# Altium schematic sheet DDR3.SchDoc
size A3; SheetNumber: 3; SheetTotal: 13; SPICEModelCacheAHASEUHE: <root> / <DocumentId>AHASEUHE</DocumentId> / </root>
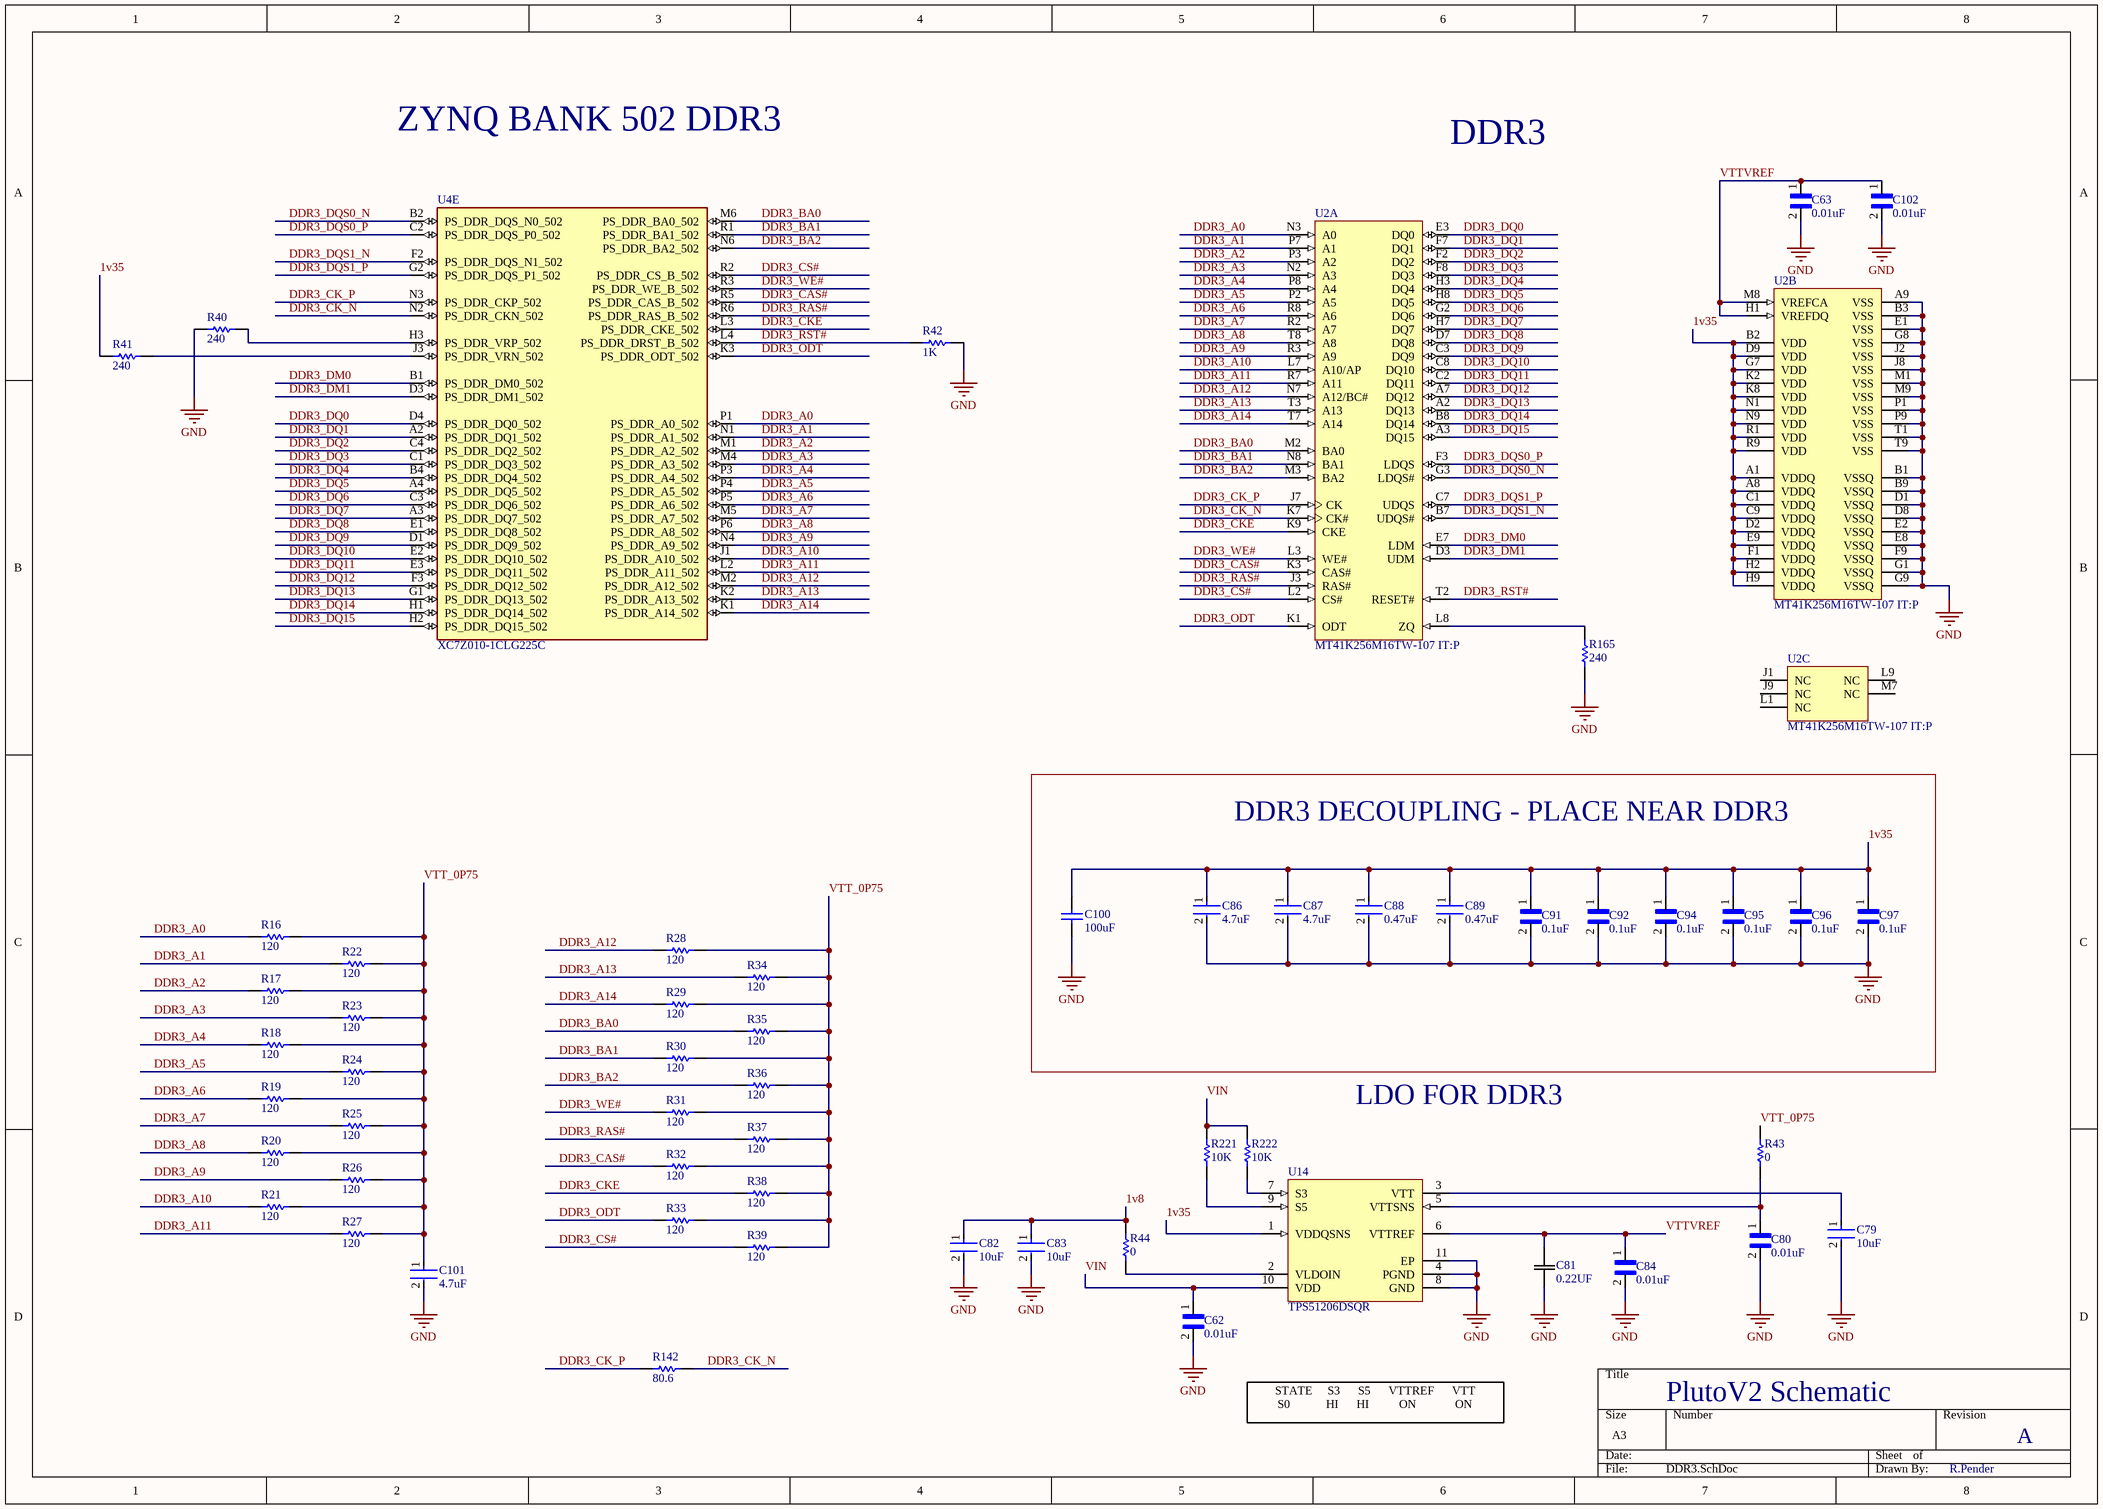
[diagram p0: DDR3.SchDoc]

## Parts
C62  0.01uF  [CAPC0603X33N]
C63  0.01uF  [CAPC0603X33N]
C79  10uF  [FP-GRM188-0_1-e0_2_0_55-IPC_A]
C80  0.01uF  [CAPC0603X33N]
C81  0.22UF  [CAP_U_0805_KNO]
C82  10uF  [FP-GRM188-0_1-e0_2_0_55-IPC_A]
C83  10uF  [FP-GRM188-0_1-e0_2_0_55-IPC_A]
C84  0.01uF  [CAPC0603X33N]
C86  4.7uF  [FP-C1005-050-0_15-MFG]
C87  4.7uF  [FP-C1005-050-0_15-MFG]
C88  0.47uF  [FP-C1005-050-0_15-MFG]
C89  0.47uF  [FP-C1005-050-0_15-MFG]
C91  0.1uF  [CAPC0603X33N]
C92  0.1uF  [CAPC0603X33N]
C94  0.1uF  [CAPC0603X33N]
C95  0.1uF  [CAPC0603X33N]
C96  0.1uF  [CAPC0603X33N]
C97  0.1uF  [CAPC0603X33N]
C100  100uF  [CAPC3216X190X55ML30T25]
C101  4.7uF  [FP-C1005-050-0_15-MFG]
C102  0.01uF  [CAPC0603X33N]
R16  120  [1-0201]
R17  120  [1-0201]
R18  120  [1-0201]
R19  120  [1-0201]
R20  120  [1-0201]
R21  120  [1-0201]
R22  120  [1-0201]
R23  120  [1-0201]
R24  120  [1-0201]
R25  120  [1-0201]
R26  120  [1-0201]
R27  120  [1-0201]
R28  120  [1-0201]
R29  120  [1-0201]
R30  120  [1-0201]
R31  120  [1-0201]
R32  120  [1-0201]
R33  120  [1-0201]
R34  120  [1-0201]
R35  120  [1-0201]
R36  120  [1-0201]
R37  120  [1-0201]
R38  120  [1-0201]
R39  120  [1-0201]
R40  240  [2-0402]
R41  240  [2-0402]
R42  1K  [2-0402]
R43  0  [RESC1005X40X25NL10T10]
R44  0  [RESC1005X40X25NL10T10]
R142  80.6  [2-0402]
R165  240  [2-0402]
R221  10K  [2-0402]
R222  10K  [2-0402]
U2  MT41K256M16TW-107 IT:P  [MICT-TW-96]  (parts A,B,C of 3)
U4  XC7Z010-1CLG225C  [BGA225C80P15X15_1300X1300X150]  (part E of 6)
U14  TPS51206DSQR  [DSQ0010A_V]

## Blocks framed on the sheet
DDR3 DECOUPLING - PLACE NEAR DDR3: C86-C89 C91 C92 C94-C97 C100

## Nets
GND: C62.2 C63.2 C79.2 C80.2 C81.2 C82.2 C83.2 C84.2 C86.2 C87.2 C88.2 C89.2 C91.2 C92.2 C94.2 C95.2 C96.2 C97.2 C100.2 C101.2 C102.2 R40.1 R42.2 R165.2 U2.A9(VSS) U2.B1(VSSQ) U2.B3(VSS) U2.B9(VSSQ) U2.D1(VSSQ) U2.D8(VSSQ) U2.E1(VSS) U2.E2(VSSQ) U2.E8(VSSQ) U2.F9(VSSQ) U2.G1(VSSQ) U2.G8(VSS) U2.G9(VSSQ) U2.J2(VSS) U2.J8(VSS) U2.M1(VSS) U2.M9(VSS) U2.P1(VSS) U2.P9(VSS) U2.T1(VSS) U2.T9(VSS) U14.4(PGND) U14.8(GND) U14.11(EP)
1v8: C82.1 C83.1 R44.1
1v35: C86.1 C87.1 C88.1 C89.1 C91.1 C92.1 C94.1 C95.1 C96.1 C97.1 C100.1 R41.1 U2.A1(VDDQ) U2.A8(VDDQ) U2.B2(VDD) U2.C1(VDDQ) U2.C9(VDDQ) U2.D2(VDDQ) U2.D9(VDD) U2.E9(VDDQ) U2.F1(VDDQ) U2.G7(VDD) U2.H2(VDDQ) U2.H9(VDDQ) U2.K2(VDD) U2.K8(VDD) U2.N1(VDD) U2.N9(VDD) U2.R1(VDD) U2.R9(VDD) U14.1(VDDQSNS)
DDR3_A0: R16.1 U2.N3(A0) U4.P1(PS_DDR_A0_502)
DDR3_A1: R22.1 U2.P7(A1) U4.N1(PS_DDR_A1_502)
DDR3_A2: R17.1 U2.P3(A2) U4.M1(PS_DDR_A2_502)
DDR3_A3: R23.1 U2.N2(A3) U4.M4(PS_DDR_A3_502)
DDR3_A4: R18.1 U2.P8(A4) U4.P3(PS_DDR_A4_502)
DDR3_A5: R24.1 U2.P2(A5) U4.P4(PS_DDR_A5_502)
DDR3_A6: R19.1 U2.R8(A6) U4.P5(PS_DDR_A6_502)
DDR3_A7: R25.1 U2.R2(A7) U4.M5(PS_DDR_A7_502)
DDR3_A8: R20.1 U2.T8(A8) U4.P6(PS_DDR_A8_502)
DDR3_A9: R26.1 U2.R3(A9) U4.N4(PS_DDR_A9_502)
DDR3_A10: R21.1 U2.L7(A10/AP) U4.J1(PS_DDR_A10_502)
DDR3_A11: R27.1 U2.R7(A11) U4.L2(PS_DDR_A11_502)
DDR3_A12: R28.1 U2.N7(A12/BC#) U4.M2(PS_DDR_A12_502)
DDR3_A13: R34.1 U2.T3(A13) U4.K2(PS_DDR_A13_502)
DDR3_A14: R29.1 U2.T7(A14) U4.K1(PS_DDR_A14_502)
DDR3_BA0: R35.1 U2.M2(BA0) U4.M6(PS_DDR_BA0_502)
DDR3_BA1: R30.1 U2.N8(BA1) U4.R1(PS_DDR_BA1_502)
DDR3_BA2: R36.1 U2.M3(BA2) U4.N6(PS_DDR_BA2_502)
DDR3_CAS#: R32.1 U2.K3(CAS#) U4.R5(PS_DDR_CAS_B_502)
DDR3_CK_N: R142.2 U2.K7(CK#) U4.N2(PS_DDR_CKN_502)
DDR3_CK_P: R142.1 U2.J7(CK) U4.N3(PS_DDR_CKP_502)
DDR3_CKE: R38.1 U2.K9(CKE) U4.L3(PS_DDR_CKE_502)
DDR3_CS#: R39.1 U2.L2(CS#) U4.R2(PS_DDR_CS_B_502)
DDR3_DM0: U2.E7(LDM) U4.B1(PS_DDR_DM0_502)
DDR3_DM1: U2.D3(UDM) U4.D3(PS_DDR_DM1_502)
DDR3_DQ0: U2.E3(DQ0) U4.D4(PS_DDR_DQ0_502)
DDR3_DQ1: U2.F7(DQ1) U4.A2(PS_DDR_DQ1_502)
DDR3_DQ2: U2.F2(DQ2) U4.C4(PS_DDR_DQ2_502)
DDR3_DQ3: U2.F8(DQ3) U4.C1(PS_DDR_DQ3_502)
DDR3_DQ4: U2.H3(DQ4) U4.B4(PS_DDR_DQ4_502)
DDR3_DQ5: U2.H8(DQ5) U4.A4(PS_DDR_DQ5_502)
DDR3_DQ6: U2.G2(DQ6) U4.C3(PS_DDR_DQ6_502)
DDR3_DQ7: U2.H7(DQ7) U4.A3(PS_DDR_DQ7_502)
DDR3_DQ8: U2.D7(DQ8) U4.E1(PS_DDR_DQ8_502)
DDR3_DQ9: U2.C3(DQ9) U4.D1(PS_DDR_DQ9_502)
DDR3_DQ10: U2.C8(DQ10) U4.E2(PS_DDR_DQ10_502)
DDR3_DQ11: U2.C2(DQ11) U4.E3(PS_DDR_DQ11_502)
DDR3_DQ12: U2.A7(DQ12) U4.F3(PS_DDR_DQ12_502)
DDR3_DQ13: U2.A2(DQ13) U4.G1(PS_DDR_DQ13_502)
DDR3_DQ14: U2.B8(DQ14) U4.H1(PS_DDR_DQ14_502)
DDR3_DQ15: U2.A3(DQ15) U4.H2(PS_DDR_DQ15_502)
DDR3_DQS0_N: U2.G3(LDQS#) U4.B2(PS_DDR_DQS_N0_502)
DDR3_DQS0_P: U2.F3(LDQS) U4.C2(PS_DDR_DQS_P0_502)
DDR3_DQS1_N: U2.B7(UDQS#) U4.F2(PS_DDR_DQS_N1_502)
DDR3_DQS1_P: U2.C7(UDQS) U4.G2(PS_DDR_DQS_P1_502)
DDR3_ODT: R33.1 U2.K1(ODT) U4.K3(PS_DDR_ODT_502)
DDR3_RAS#: R37.1 U2.J3(RAS#) U4.R6(PS_DDR_RAS_B_502)
DDR3_RST#: R42.1 U2.T2(RESET#) U4.L4(PS_DDR_DRST_B_502)
DDR3_WE#: R31.1 U2.L3(WE#) U4.R3(PS_DDR_WE_B_502)
VIN: C62.1 R221.1 R222.1 U14.10(VDD)
VTT_0P75: C101.1 R16.2 R17.2 R18.2 R19.2 R20.2 R21.2 R22.2 R23.2 R24.2 R25.2 R26.2 R27.2 R28.2 R29.2 R30.2 R31.2 R32.2 R33.2 R34.2 R35.2 R36.2 R37.2 R38.2 R39.2 R43.1
VTTVREF: C63.1 C81.1 C84.1 C102.1 U2.H1(VREFDQ) U2.M8(VREFCA) U14.6(VTTREF)
NetC79_1: C79.1 U14.3(VTT)
NetC80_1: C80.1 R43.2 U14.5(VTTSNS)
NetR40_2: R40.2 U4.H3(PS_DDR_VRP_502)
NetR41_2: R41.2 U4.J3(PS_DDR_VRN_502)
NetR44_2: R44.2 U14.2(VLDOIN)
NetR165_1: R165.1 U2.L8(ZQ)
NetR221_2: R221.2 U14.9(S5)
NetR222_2: R222.2 U14.7(S3)

Not connected (* = marked no-connect by the designer): U2 J1(NC) J9(NC) L1(NC) L9(NC) M7(NC)

## Notes on the sheet
- ZYNQ BANK 502 DDR3
- DDR3
- LDO FOR DDR3
- STATE     S3      S5      VTTREF      VTT                                       S0            HI      HI          ON             ON
- PlutoV2 Schematic
- A
- R.Pender

## Library data of the parts
C62 C63 C80 C84 C102 = GRM033R71A103KA01D: SMD Capacitor X7R(EIA) with Capacitance: 10000pF Tol. 10%. Rated Voltage: 10Vdc; MF: Murata; Package: 0603 Taiyo Yuden; MP: GRM033R71A103KA01D; Value: *; SnapEDA_Link: https://www.snapeda.com/parts/GRM033R71A103KA01D/Murata/view-part/4379446/?ref=snap; Availability: Unavailable; Price: None; Check_prices: https://www.snapeda.com/parts/GRM033R71A103KA01D/Murata/view-part/4379446/?ref=eda
C79 C82 C83 = CMP-2006-02792-2: Chip Multilayer Ceramic Capacitors for General Purpose, 0603, 10uF, X5R, 15%, 20%, 6.3V; Packaging: Tape and Reel; Voltage Rating (DC): 6.3V; Width: 0.031inch; Termination: SMD/SMT; Dielectric: X5R; Package Quantity: 4000; Voltage Rating: 6.3V; Capacitance: 10uF; Case/Package: 0603; Min Operating Temperature: -55°C; Voltage: 6.3V; Length: 1.6mm; Thickness: 0.035inch; Lead Free: Lead Free; Depth: 0.8mm; Case Code (Imperial): 0603; Max Operating Temperature: 85°C; Material: Ceramic; Height: 0.8mm; Tolerance: 20%; Mount: Surface Mount; REACH SVHC: No SVHC; Radiation Hardening: No; Case Code (Metric): 1608
C81 = 080530250224KXT: No Description Available; Mfr_Name: Knowles; Type: DEV; Copyright: Copyright (C) 2022 Ultra Librarian. All rights reserved.; Manufacturer_Part_Number: 080530250224KXT; Digi-Key_Part_Number_1: 1608-1296-2-ND; Digi-Key_Part_Number_2: 1608-1296-1-ND; Digi-Key_Part_Number_3: 1608-1296-6-ND; RefDes: RefDes
C86-C89 C101 = CMP-2000-05437-2: CAP CER 4.7UF 6.3V X5R 0402; Tolerance: 10%; Dielectric Material: Ceramic; Voltage: 6.3V; Capacitance: 4.7uF; Depth: 0.5mm; Height: 0.5mm; Length: 1mm; Termination: SMD/SMT; RoHS Compliant: Yes; Series: C; Case/Package: 0402; Dielectric: X5R; Lead Free: Lead Free; Mount: Surface Mount; Max Operating Temperature: 85°C; Min Operating Temperature: -55°C
C91 C92 C94-C97 = GRM033R61C104ME84D: CAP 0.1UF 16VDC X5R 20% SMD 0201 PAPER TAPE; Package: None; Price: None; Value: *; MP: GRM033R61C104ME84D; Availability: Unavailable
C100 = CMP-1662-00011-2: Chip Capacitor, 100 uF, +/- 20%, 6.3 V, -55 to 85 degC, 1206 (3216 Metric), RoHS, Tape and Reel; PartNumber: GRM31CR60J107ME39L; Case\/Package: 1206; Voltage Rating (DC): 6.3 V; Type (Capacitors): X5R; REACH SVHC: No SVHC; Height: 1.6 mm; Tolerance: 20%; Packaging: Tape and Reel; Mount: Surface Mount; PackageDescription: 2-Pin Surface Mount Device, Body 3.2 x 1.6 mm; ComponentLink1URL: http://www.murata.com/; Pins: 2; ComponentLink2Description: Datasheet; PackageReference: 1206; Width: 1.6 mm; Package Quantity: 2000; Capacitance: 100 uF; Min Operating Temperature: -55 degC; Case Code (Imperial): 1206; Max Operating Temperature: 85 degC; DatasheetVersion: 09/2016; Mounting Technology: Surface Mount; Voltage Rating: 6.3 V; ComponentLink1Description: Manufacturer URL; Radiation Hardening: No; Case Code (Metric): 3216; Length: 3.2 mm; ComponentLink2URL: http://psearch.en.murata.com/capacitor/product/GRM31CR60J107ME39%23.pdf; RoHSCompliant: true
R16-R39 = ERJ1GE: Thick Film Chip Resistor, 10 Ohm to 1M Ohm Range, 5% Tolerance, 0201 Size, 0.05 W; Note: If flow soldering, adjust pad width of PCB Footprint to 0.7 - 0.8 times the width of the resistor.; Published: 17-Dec-2003; LatestRevisionDate: 19-Mar-2004; LatestRevisionNote: Silkscreen size reduced.; PackageDocument: Mar-2003; PackageReference: 1-0201; Publisher: Altium Limited; ComponentLink1Description: Manufacturer Link; ComponentLink1URL: http://www.panasonic.com/industrial/components/resistive_products.htm; ComponentLink2Description: Datasheet; ComponentLink2URL: http://www.panasonic.com/industrial/components/pdf/AOA0000CE1.pdf
R40-R42 R142 R165 R221 R222 = ERJ2RK: Precision Thick Film Chip Resistor, 10 Ohm to 1M Ohm Range, 1% and 0.5% Tolerance, 0402 Size, 0.063 W; Published: 17-Dec-2003; LatestRevisionDate: 19-Mar-2004; LatestRevisionNote: Silkscreen size reduced.; PackageDocument: Mar-2003; PackageReference: 2-0402; Publisher: Altium Limited; Code_IPC: 1005 [0402]; ComponentLink1Description: Manufacturer Link; ComponentLink1URL: http://www.panasonic.com/industrial/components/resistive_products.htm; ComponentLink2Description: Datasheet; ComponentLink2URL: http://www.panasonic.com/industrial/components/pdf/AOA0000CE2.pdf
R43 R44 = CMP-2002-05896-1: Part Number: MC00625W040210R; Manufacturer: Multicomp
U2 = CMP-2000-06773-2: Automotive DDR3L SDRAM, 4 GB, 933 MHz, 1.283 to 1.45 V, -40 to 95 degC, 96-Pin TFBGA, RoHS, Tray; Manufacturer: Micron; Data Bus Width: 16b; Address Bus Width: 15b; Operating Supply Voltage: 1.35V; Access Time: 1.07ns; Max Frequency: 933MHz; Density: 4Gb; Package Reference: TW-96; Max Operating Temperature: 95degC; RoHSCompliant: true; Datasheet Version: Rev. D, 02/2017; Datasheet URL: https://www.micron.com/~/media/documents/products/data-sheet/dram/ddr3/4gb_automotive_ddr3l.pdf; Mount: SurfaceMount; Min Operating Temperature: -40degC; Package Description: 96-Ball Fine Pitch Ball Grid Array, Body 14 x 8 mm, Pitch 0.8 mm; Mounting Technology: SurfaceMount; Contact Plating: Silver; Manufacturer URL: http://www.micron.com/
U4 = XC7Z010-1CLG225C: Dual ARMÂ® CortexÂ®-A9 MPCoreâ„¢ with CoreSightâ„¢ System On Chip _SOC_ IC ZynqÂ®-7000 Artixâ„¢-7 FPGA, 28K Logic Cells 667MHz 225-CSPBGA _13x13_; MF: Xilinx Inc.; Value: *; SnapEDA_Link: https://www.snapeda.com/parts/XC7Z010-1CLG225C/Xilinx%20Inc./view-part/45778/?ref=snap; Digi-Key_Part_Number: 122-1855-ND; Package: CSPBGA-225 Xilinx; Digi-Key_Purchase_URL: https://www.digikey.by/product-detail/en/xilinx-inc/XC7Z010-1CLG225C/122-1855-ND/3925788?utm_source=snapeda&utm_medium=aggregator&utm_campaign=symbol; MP: XC7Z010-1CLG225C
U14 = CMP-0395-00678-2: Single Output LDO, 2 A, with VTTREF Buffered Reference for DDR2, DDR3, DDR3L, 10-pin SON (DSQ), -40 to 85 degC, Green (RoHS & no Sb/Br); Manufacturer: Texas Instruments; SubFamily: Single Channel LDO; Iout(Max)(A): 2; Rating: Catalog; ComponentLink2Description: Datasheet; ComponentLink1URL: http://www.ti.com/; ComponentLink4URL: Samples URL:http://www.ti.com/product/tps51206#samples; PackageVersion: 4209243/B; Mounting Technology: Surface Mount; PackageReference: DSQ0010A; Eco-Plan: Green (RoHS & no Sb/Br); PackageDescription: 10-Pin Plastic Small Outline, Body 2 X 2 mm, Pitch 0.4 mm; ComponentLink4Description: URL Link1; DatasheetVersion: SLUSAH1; ComponentLink3URL: http://www.ti.com/litv/pdf/mpdi002c; ComponentLink2URL: http://www.ti.com/general/docs/lit/getliterature.tsp?genericPartNumber=TPS51206&fileType=pdf; PartNumber: TPS51206DSQR; ComponentLink3Description: Package Specification; ComponentLink1Description: Manufacturer URL